# EAGLE design kicik-up (EAGLE 7.2.0)
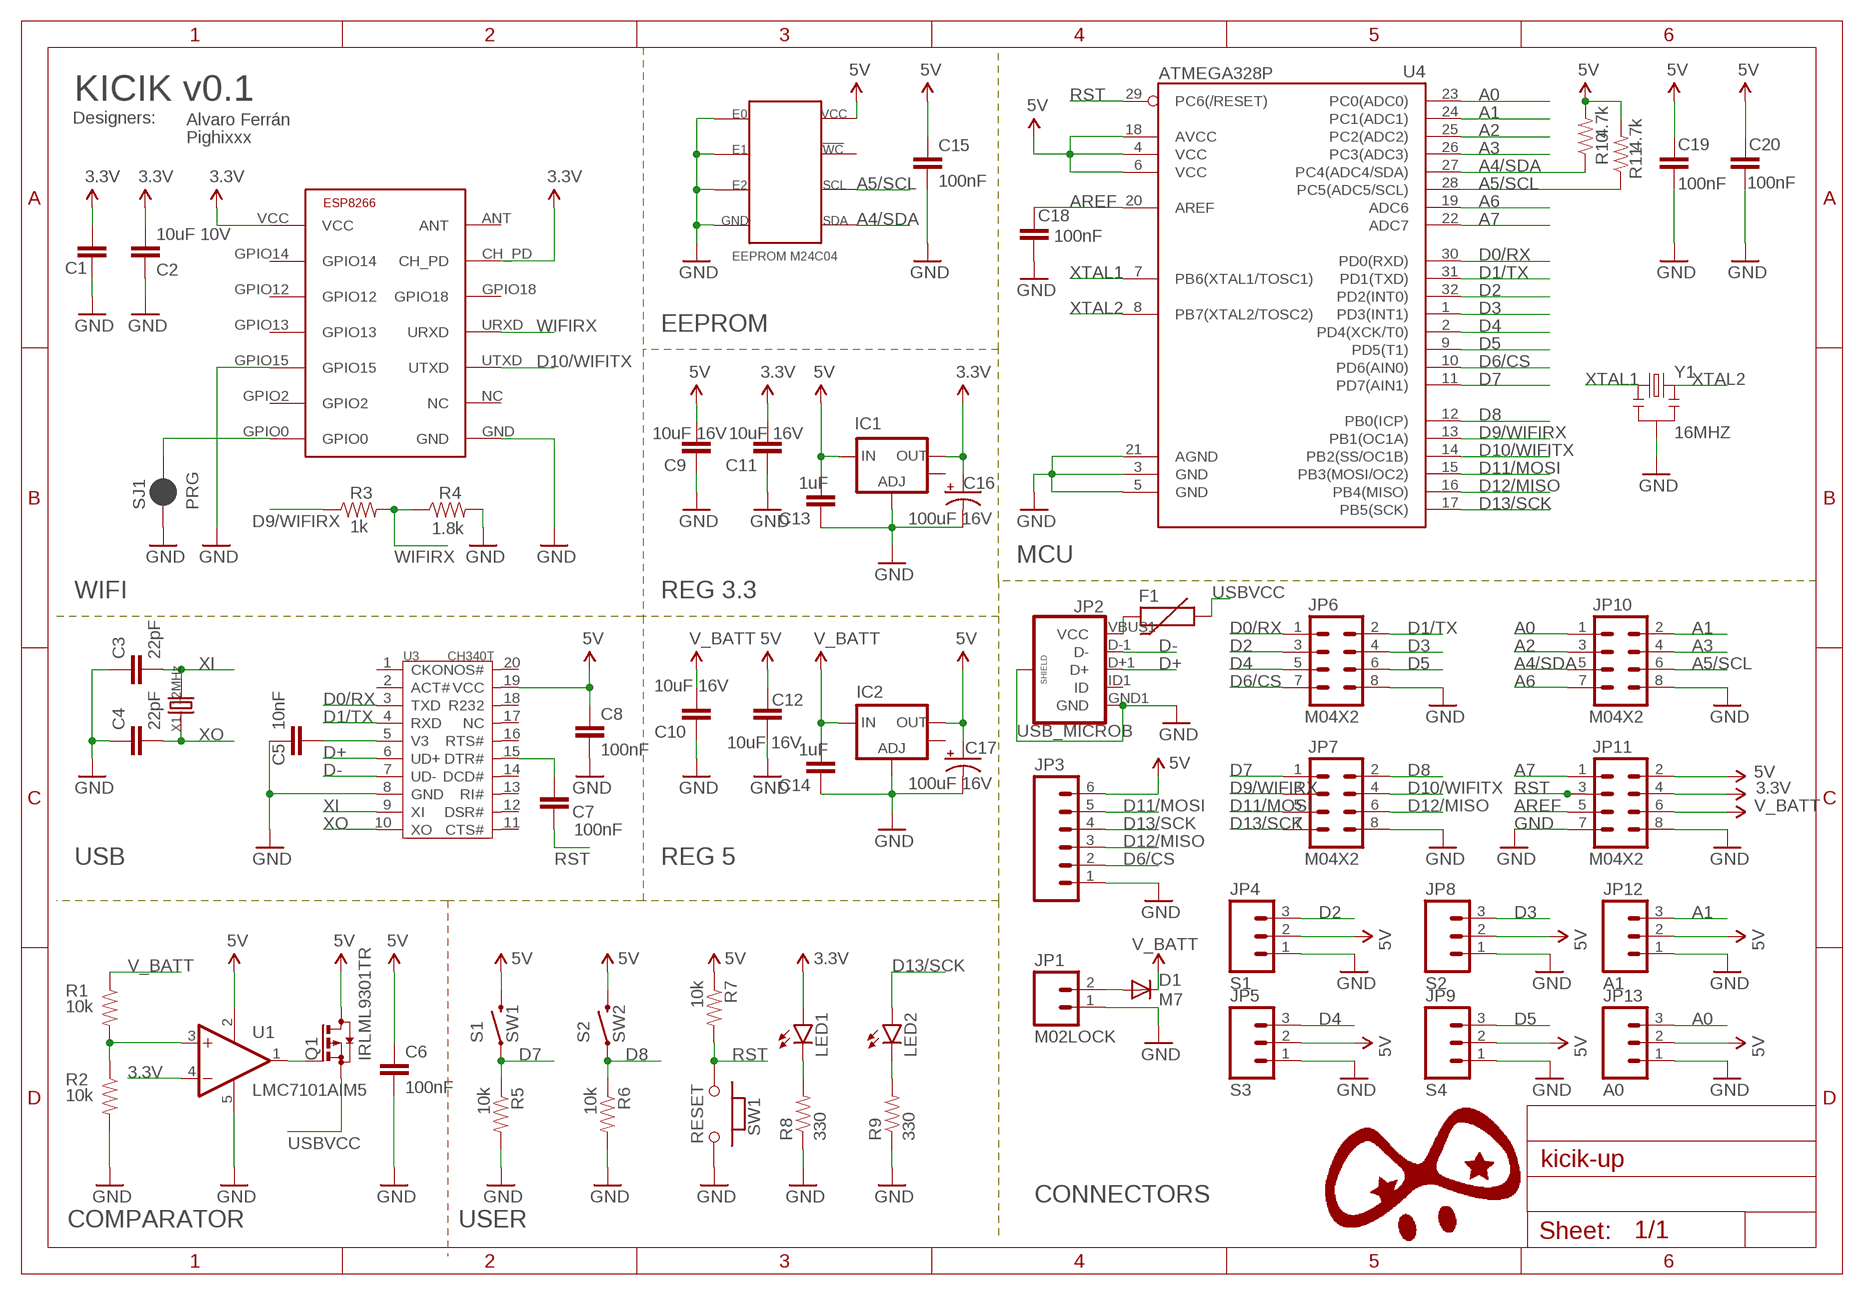
[diagram p0: schematic, sheet 1]

## Parts
C1  0.1uF  CAP0402-CAP  [0402-CAP]
C2  10uF 10V  CAP0402-CAP  [0402-CAP]
C3  22pF  CAP0402-CAP  [0402-CAP]
C4  22pF  CAP0402-CAP  [0402-CAP]
C5  10nF  CAP0402-CAP  [0402-CAP]
C6  100nF  CAP0402-CAP  [0402-CAP]
C7  100nF  CAP0402-CAP  [0402-CAP]
C8  100nF  CAP0402-CAP  [0402-CAP]
C9  10uF 16V  CAP0402-CAP  [0402-CAP]
C10  10uF 16V  CAP0402-CAP  [0402-CAP]
C11  10uF 16V  CAP0402-CAP  [0402-CAP]
C12  10uF 16V  CAP0402-CAP  [0402-CAP]
C13  1uF  CAP0402-CAP  [0402-CAP]
C14  1uF  CAP0402-CAP  [0402-CAP]
C15  100nF  CAP0402-CAP  [0402-CAP]
C16  100uF 16V  CAP_POLC  [PANASONIC_C]
C17  100uF 16V  CAP_POLC  [PANASONIC_C]
C18  100nF  CAP0402-CAP  [0402-CAP]
C19  100nF  CAP0402-CAP  [0402-CAP]
C20  100nF  CAP0402-CAP  [0402-CAP]
D1  M7  DIODE-SMB  [SMB]
F1  PTC0603  [0603]
IC1  V_REG_LM1117SOT223  [SOT223]
IC2  V_REG_LM1117SOT223  [SOT223]
JP1  M02LOCK  [1X02_LOCK]
JP2  USB_MICROB  USB_MICROB_PLUGCONN-11752  [USB-B-MICRO-SMD_V03]
JP3  M06LOCK  [1X06_LOCK]
JP4  S1  M03LOCK  [1X03_LOCK]
JP5  S3  M03LOCK  [1X03_LOCK]
JP6  M04X2  [2X4]
JP7  M04X2  [2X4]
JP8  S2  M03LOCK  [1X03_LOCK]
JP9  S4  M03LOCK  [1X03_LOCK]
JP10  M04X2  [2X4]
JP11  M04X2  [2X4]
JP12  A1  M03LOCK  [1X03_LOCK]
JP13  A0  M03LOCK  [1X03_LOCK]
LED1  LED0603  [LED-0603]
LED2  LED0603  [LED-0603]
M1  M24C04  [SO08]
Q1  IRLML9301TR  BSS84  [SOT23]
R1  10k  RESISTOR0402-RES  [0402-RES]
R2  10k  RESISTOR0402-RES  [0402-RES]
R3  1k  RESISTOR0402-RES  [0402-RES]
R4  1.8k  RESISTOR0402-RES  [0402-RES]
R5  10k  RESISTOR0402-RES  [0402-RES]
R6  10k  RESISTOR0402-RES  [0402-RES]
R7  10k  RESISTOR0402-RES  [0402-RES]
R8  330  RESISTOR0402-RES  [0402-RES]
R9  330  RESISTOR0402-RES  [0402-RES]
R10  4.7k  RESISTOR0402-RES  [0402-RES]
R11  4.7k  RESISTOR0402-RES  [0402-RES]
S1  SW1  SWITCH-MOMENTARY-2SIDE_EZ  [TACTILE-PTH-SIDEEZ]
S2  SW2  SWITCH-MOMENTARY-2SIDE_EZ  [TACTILE-PTH-SIDEEZ]
SJ1  PRG  JUMPER-PAD-2-NC_BY_PASTE  [PAD-JUMPER-2-NC_BY_PASTE_YES_SILK]
SW1  RESET  PB157  [157SW]
U1  LMC7101AIM5  [SOT23-5]
U2  ESP8266  [ESP-03]
U3  CH340T  [SSOP20]
U4  ATMEGA328P  ATMEGA328_SMT  [TQFP32-08]
X1  12MHz  CRYSTAL'5032'  [2P-SMD-5X3.2]
Y1  16MHZ  RESONATOR16MHZ  [RESONATOR-SMD]

## Nets
3.3V: C1.2 C2.2 C11.2 C16.+ IC1.2(OUT) JP11.4 LED1.A U1.4(-IN) U2.CH_PD U2.VCC
5V: C6.1 C8.1 C9.2 C12.2 C13.2 C15.1 C17.+ C19.1 C20.1 IC1.3(IN) IC2.2(OUT) JP3.6 JP4.2 JP5.2 JP8.2 JP9.2 JP11.2 JP12.2 JP13.2 M1.8(VCC) Q1.3(D) R7.1 R10.2 R11.2 S1.2 S2.2 U1.2(V+) U3.19(VCC) U4.4(VCC) U4.6(VCC) U4.18(AVCC)
A0: JP10.1 JP13.3 U4.23(PC0(ADC0))
A1: JP10.2 JP12.3 U4.24(PC1(ADC1))
A2: JP10.3 U4.25(PC2(ADC2))
A3: JP10.4 U4.26(PC3(ADC3))
A4/SDA: JP10.5 M1.5(SDA) R10.1 U4.27(PC4(ADC4/SDA))
A5/SCL: JP10.6 M1.6(SCL) R11.1 U4.28(PC5(ADC5/SCL))
A6: JP10.7 U4.19(ADC6)
A7: JP11.1 U4.22(ADC7)
AREF: C18.1 JP11.5 U4.20(AREF)
D0/RX: JP6.1 U3.3(TXD) U4.30(PD0(RXD))
D1/TX: JP6.2 U3.4(RXD) U4.31(PD1(TXD))
D2: JP4.3 JP6.3 U4.32(PD2(INT0))
D3: JP6.4 JP8.3 U4.1(PD3(INT1))
D4: JP5.3 JP6.5 U4.2(PD4(XCK/T0))
D5: JP6.6 JP9.3 U4.9(PD5(T1))
D6/CS: JP3.2 JP6.7 U4.10(PD6(AIN0))
D7: JP7.1 R5.1 S1.1 U4.11(PD7(AIN1))
D8: JP7.2 R6.1 S2.1 U4.12(PB0(ICP))
D9/WIFIRX: JP7.3 R3.1 U4.13(PB1(OC1A))
D10/WIFITX: JP7.4 U2.UTXD U4.14(PB2(SS/OC1B))
D11/MOSI: JP3.5 JP7.5 U4.15(PB3(MOSI/OC2))
D12/MISO: JP3.3 JP7.6 U4.16(PB4(MISO))
D13/SCK: JP3.4 JP7.7 LED2.A U4.17(PB5(SCK))
D+: JP2.D+1(D+) U3.6(UD+)
D-: JP2.D-1(D-) U3.7(UD-)
GND: C1.1 C2.1 C3.1 C4.1 C5.1 C6.2 C8.2 C9.1 C10.1 C11.1 C12.1 C13.1 C14.1 C15.2 C16.- C17.- C18.2 C19.2 C20.2 IC1.1(ADJ) IC2.1(ADJ) JP1.1 JP2.GND1(GND) JP2.SHIELD1(SHIELD) JP2.SHIELD2(SHIELD) JP2.SHIELD3(SHIELD) JP3.1 JP4.1 JP5.1 JP6.8 JP7.8 JP8.1 JP9.1 JP10.8 JP11.7 JP11.8 JP12.1 JP13.1 M1.1(E0) M1.2(E1) M1.3(E2) M1.4(GND) R2.2 R4.2 R5.2 R6.2 R8.1 R9.1 SJ1.1 SW1.2 U1.5(V-) U2.GND U2.GPIO15 U3.8(GND) U4.3(GND) U4.5(GND) U4.21(AGND) Y1.2
N$1: C7.1 U3.15(DTR#)
N$2: LED1.C R8.2
N$3: F1.2 JP2.VBUS1(VCC)
N$4: R1.2 R2.1 U1.3(+IN)
N$6: SJ1.2 U2.GPIO0
N$8: D1.A JP1.2
N$22: LED2.C R9.2
N$25: Q1.1(G) U1.1(OUT)
RST: C7.2 JP11.3 R7.2 SW1.1 U4.29(PC6(/RESET))
USBVCC: F1.1 Q1.2(S)
V3: C5.2 U3.5(V3)
V_BATT: C10.2 C14.2 D1.C IC2.3(IN) JP11.6 R1.1
WIFIRX: R3.2 R4.1 U2.URXD
XI: C3.2 U3.9(XI) X1.2
XO: C4.2 U3.10(XO) X1.1
XTAL1: U4.7(PB6(XTAL1/TOSC1)) Y1.1
XTAL2: U4.8(PB7(XTAL2/TOSC2)) Y1.3
Unconnected: IC1.4(OUT) IC2.4(OUT) JP2.ID1(ID) M1.7(!WC) U2.ANT U2.GPIO2 U2.GPIO12 U2.GPIO13 U2.GPIO14 U2.GPIO18 U2.NC U3.1(CKO) U3.2(ACT#) U3.11(CTS#) U3.12(DSR#) U3.13(RI#) U3.14(DCD#) U3.16(RTS#) U3.17(NC) U3.18(R232) U3.20(NOS#)

## Notes on the sheet
- KICIK v0.1
- Designers: | Alvaro Ferrán
- Pighixxx
- EEPROM
- MCU
- WIFI | REG 3.3
- USB | REG 5
- CONNECTORS
- COMPARATOR | USER

## Library data of the parts
C1-C15 C18-C20 = SparkFun-Passives:CAP: Capacitor Standard 0603 ceramic capacitor, and 0.1" leaded capacitor.
C16 C17 = SparkFun-Capacitors:CAP_POL: Capacitor Polarized These are standard SMD and PTH capacitors. Normally 10uF, 47uF, and 100uF in electrolytic and tantalum varieties. Always verify the external diameter of the through hole cap, it varies with capacity, voltage, and manufacturer. The EIA devices should be standard.
D1 = diode:DIODE-: DIODE
F1 = SparkFun-PowerIC:PTC: Resettable Fuse PTC Resettable Fuse. Spark Fun Electronics SKU : COM-08357
IC1 IC2 = SparkFun-PowerIC:V_REG_LM1117: Voltage Regulator LM1117 Standard adjustable voltage regulator but in SMD form. Spark Fun Electronics SKU : COM-00595; PROD_ID: VREG-08170
JP1 = SparkFun-Connectors:M02: Standard 2-pin 0.1" header. Use with - straight break away headers ( PRT-00116) - right angle break away headers (PRT-00553) - swiss pins (PRT-00743) - machine pins (PRT-00117) - female headers (PRT-00115) Molex polarized connector foot print use with: PRT-08233 with associated crimp pins and housings. 2.54_SCREWTERM for use with PRT-10571. 3.5mm Screw Terminal footprints for PRT-08084 5mm Screw Terminal footprints for use with PRT-08432
JP2 = SparkFun-Connectors:USB_MICROB_PLUG: USB Micro-B connectors Some male, some female. Watch your step!; PROD_ID: CONN-11752
JP3 = SparkFun-Connectors:M06: Header 6 Standard 6-pin 0.1" header. Use with straight break away headers (SKU : PRT-00116), right angle break away headers (PRT-00553), swiss pins (PRT-00743), machine pins (PRT-00117), and female headers (PRT-00115). Molex polarized connector foot print use with SKU : PRT-08094 with associated crimp pins and housings. NOTES ON THE VARIANTS LOCK and LOCK_LONGPADS... This footprint was designed to help hold the alignment of a through-hole component (i.e. 6-pin header) while soldering it into place. You may notice that each hole has been shifted either up or down by 0.005 of an inch from it's more standard position (which is a perfectly straight line). This slight alteration caused the pins (the squares in the middle) to touch the edges of the holes. Because they are alternating, it causes a "brace" to hold the component in place. 0.005 has proven to be the perfect amount of "off-center" position when using our standard breakaway headers. Although looks a little odd when you look at the bare footprint, once you have a header in there, the alteration is very hard to notice. Also,if you push a header all the way into place, it is covered up entirely on the bottom side. This idea of altering the position of holes to aid alignment will be further integrated into the Sparkfun Library for other footprints. It can help hold any component with 3 or more connection pins.
JP4 JP5 JP8 JP9 JP12 JP13 = SparkFun-Connectors:M03: Header 3 Standard 3-pin 0.1" header. Use with straight break away headers (SKU : PRT-00116), right angle break away headers (PRT-00553), swiss pins (PRT-00743), machine pins (PRT-00117), and female headers (PRT-00115). Molex polarized connector foot print use with SKU : PRT-08232 with associated crimp pins and housings.
JP6 JP7 JP10 JP11 = SparkFun-Connectors:M04X2: .1" header, two rows of four.
LED1 LED2 = SparkFun-LED:LED: LEDs Standard schematic elements and footprints for 5mm, 3mm, 1206, and 0603 sized LEDs. 5mm - Spark Fun Electronics SKU : COM-00529 (and others)
M1 = pighiXXX:M24C04: ST MICROELECTRONICS M24C04-WMN6P Memory; EEPROM; I2C; 512x8bit; 2.5÷5.5V; SO8
Q1 = transistor-small-signal:BSS84: P-CHANNEL MOS FET
R1-R11 = SparkFun-Passives:RESISTOR: Resistor Basic schematic elements and footprints for 0603, 1206, and PTH resistors.
S1 S2 = SparkFun-Electromechanical:SWITCH-MOMENTARY-2: Various NO switches- pushbuttons, reed, etc
SJ1 = SparkFun-Passives:JUMPER-PAD-2-NC_BY_PASTE
SW1 = MySMD:PB157
U1 = linear:LMC7101AIM5
U2 = ESP8266:ESP8266: low cost Wifi to Serial Module
U3 = template:CH340T
U4 = SparkFun-DigitalIC:ATMEGA328_SMT: 32-Pin Atmega328 part Commonly used on Arduino compatible boards Available in QFP and QFN packages TQFP is IC-09069 QFN is non-stock; PROD_ID: IC-09069
X1 = Discrete:CRYSTAL*: CRYSTAL
Y1 = SparkFun-FreqCtrl:RESONATOR: Resonator Small SMD resonator. Used, eg, on the Arduino Pro/ Pro Mini boards. 8MHz- XTAL-08895 16MHz- XTAL-08900; PROD_ID: XTAL-08900

## Net classes
0 default: width 0.254 mm, drill 0.254 mm, clearance 0.203 mm
1 power: width 0.61 mm, drill 0.61 mm, clearance 0.254 mm
2 gnd: width 0.305 mm, drill 0.559 mm, clearance 0.254 mm
3 usbvcc: width 0.508 mm, drill 0.61 mm, clearance 0.254 mm
4 aref: width 0.406 mm, drill 0.61 mm, clearance 0.254 mm

## Board
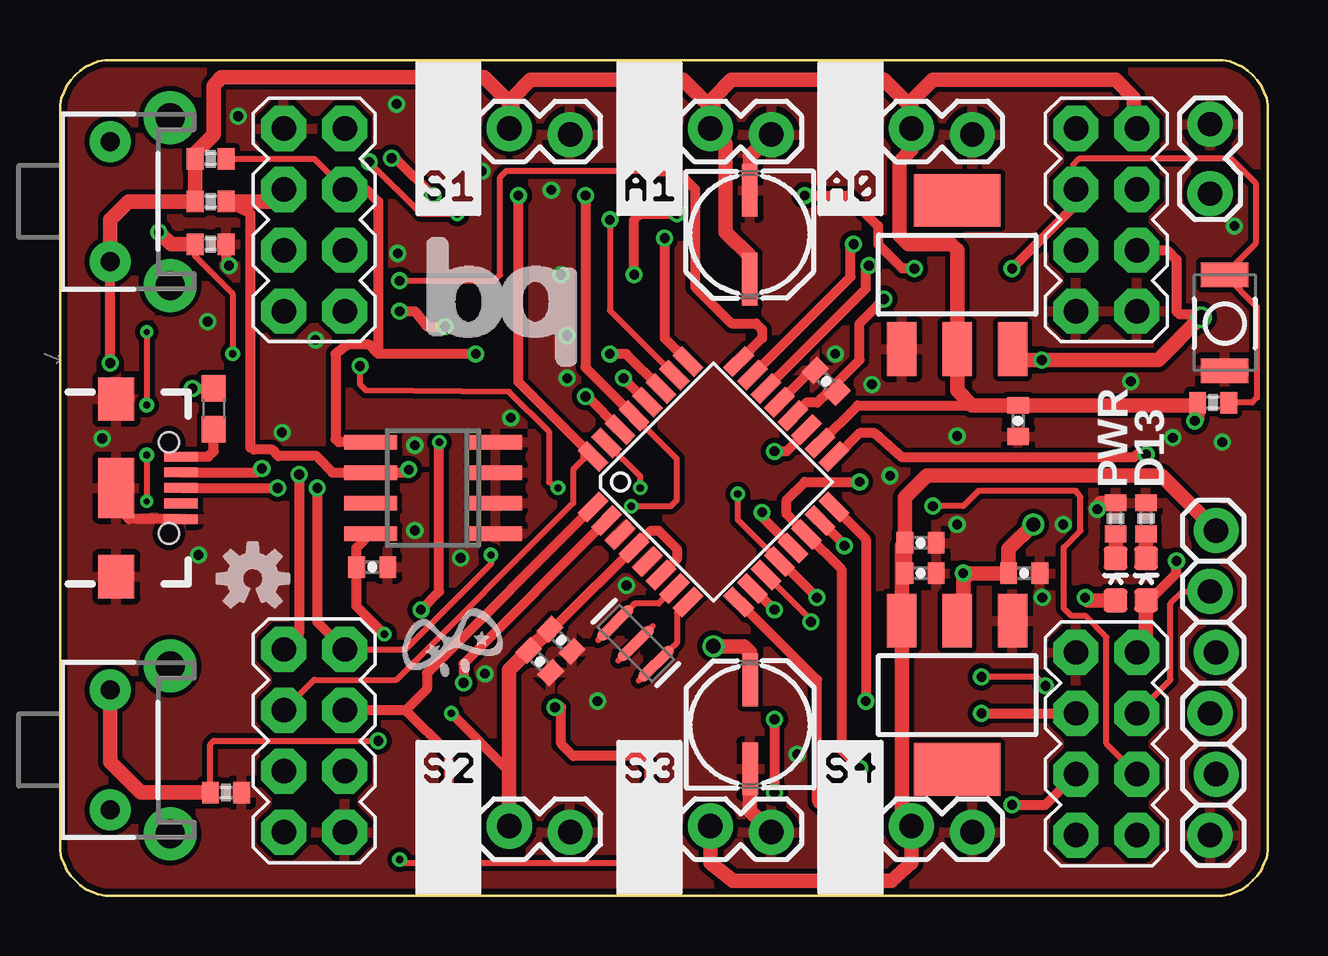
[diagram p1: board, top side]
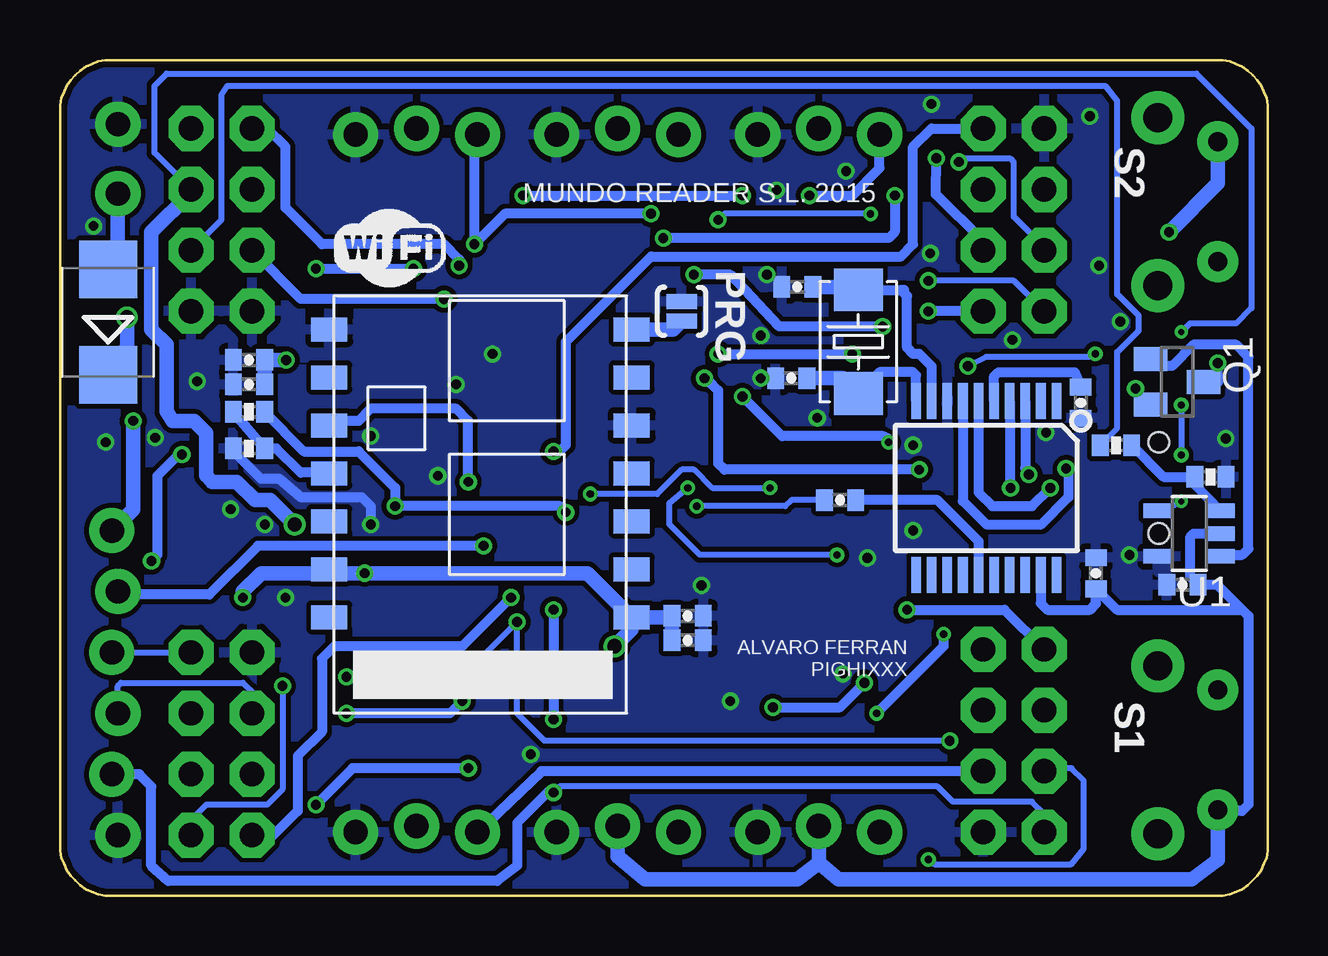
[diagram p2: board, bottom side, seen from below]

Size 50.35 x 34.84 mm. Coordinates in mm from the lower left corner, seen from the top.
Outline: 50.35,32.97 50.35,1.88 50.29,1.59 50.18,1.33 50.07,1.07 49.91,0.84 49.71,0.64 49.52,0.44 49.28,0.28 49.02,0.17 48.76,0.06 48.48,0 1.88,0 1.59,0.06 1.33,0.17 1.07,0.28 0.84,0.44 0.44,0.84 0.28,1.07 0.17,1.33 0.06,1.59 0,1.88 0,32.97 0.06,33.25 0.17,33.51 0.28,33.78 0.44,34.01 0.64,34.21 0.84,34.4 1.07,34.56 1.33,34.67 1.59,34.78 1.88,34.84 48.48,34.84 48.76,34.78 49.02,34.67 49.28,34.56 49.52,34.4 49.71,34.21 49.91,34.01 50.07,33.78 50.18,33.51 50.29,33.25 50.35,32.97
Copper layers (1*16): Top 0.035mm / dielectric 1.5mm / Bottom 0.035mm
Design rules "pighixxx_CAM_DRC_V1.0": minimum track width 6mil, minimum drill 12mil, track to track 6mil, track to pad 6mil, pad to pad 6mil, via to via 6mil, smd to smd 0mil, copper to edge 10mil, drill to drill 10mil, minimum pad ring 10mil, minimum via ring 6mil, stop-mask expansion 2mil, vias tented up to drill 100mil, thermal gap 10mil

### Footprints (pad centres in the part's own frame; a part is rotated, then mirrored left to right if it is on the bottom)
0402-CAP = smd 0.7 x 0.9: 1 -0.65,0; 2 0.65,0
PANASONIC_C = smd 2.2 x 0.65: + 1.9,-0.2; - -1.8,-0.2
SMB = smd 2.4 x 2.4: A 2.2,0; C -2.2,0
0603 = smd 1.1 x 1: 1 -0.85,0; 2 0.85,0
SOT223 = smd 1.219 x 2.235: 1 -2.311,-3.099; 2 0,-3.099; 3 2.311,-3.099 | smd 3.6 x 2.2: 4 0,3.099
1X02_LOCK = drill 1.016 pad 1.88: 1 -0.178,0; 2 2.718,0
USB-B-MICRO-SMD_V03 = smd 1.4 x 0.4: D+1 2.7,0; D-1 2.7,0.65; GND1 2.7,-1.3; ID1 2.7,-0.65; VBUS1 2.7,1.3 | smd 1.5 x 1.8: SHIELD1 0,3.7; SHIELD2 0,-3.7 | smd 1.5 x 2.5: SHIELD3 0,0 | hole 0.85: 2.2,1.9; 2.2,-1.9
1X06_LOCK = drill 1.016 pad 1.88: 1 0,0; 2 2.54,-0.254; 3 5.08,0; 4 7.62,-0.254; 5 10.16,0; 6 12.7,-0.254
1X03_LOCK = drill 1.016 pad 1.88: 1 0,0.127; 2 2.54,-0.127; 3 5.08,0.127
2X4 = drill 1.016 pad 1.88 octagon: 1 -3.81,-1.27; 2 -3.81,1.27; 3 -1.27,-1.27; 4 -1.27,1.27; 5 1.27,-1.27; 6 1.27,1.27; 7 3.81,-1.27; 8 3.81,1.27
LED-0603 = smd 1 x 1: A 0,-0.877; C 0,0.877
SO08 = smd 0.6 x 2.2: 1 -1.905,-2.6; 2 -0.635,-2.6; 3 0.635,-2.6; 4 1.905,-2.6; 5 1.905,2.6; 6 0.635,2.6; 7 -0.635,2.6; 8 -1.905,2.6
SOT23 = smd 1 x 1.4: 1 -0.95,-1.1; 2 0.95,-1.1; 3 0,1.1
0402-RES = smd 0.7 x 0.9: 1 -0.65,0; 2 0.65,0
TACTILE-PTH-SIDEEZ = drill 0.8 pad 1.7: 1 -2.5,0; 2 2.5,0 | drill 1.2 pad 2.2: ANCHOR1 -3.5,2.5; ANCHOR2 3.5,2.5
PAD-JUMPER-2-NC_BY_PASTE_YES_SILK = smd 0.635 x 1.27: 1 -0.401,0; 2 0.413,0
157SW = smd 1.016 x 1.981: 1 0,0; 2 4,0
SOT23-5 = smd 0.6 x 1.2: 1 -0.95,-1.306; 2 0,-1.306; 3 0.95,-1.306; 4 0.95,1.306; 5 -0.95,1.306
ESP-03 = smd 1 x 1.5: ANT 4,12.4; CH_PD 6,12.4; GND 16,12.4; GPIO0 16,-0.2; GPIO2 14,-0.2; GPIO12 8,-0.2; GPIO13 10,-0.2; GPIO14 6,-0.2; GPIO15 12,-0.2; GPIO18 8,12.4; NC 14,12.4; URXD 10,12.4; UTXD 12,12.4; VCC 4,-0.2
SSOP20 = smd 0.4 x 1.5: 1 -2.925,-3.625; 2 -2.275,-3.625; 3 -1.625,-3.625; 4 -0.975,-3.625; 5 -0.325,-3.625; 6 0.325,-3.625; 7 0.975,-3.625; 8 1.625,-3.625; 9 2.275,-3.625; 10 2.925,-3.625; 11 2.925,3.625; 12 2.275,3.625; 13 1.625,3.625; 14 0.975,3.625; 15 0.325,3.625; 16 -0.325,3.625; 17 -0.975,3.625; 18 -1.625,3.625; 19 -2.275,3.625; 20 -2.925,3.625
TQFP32-08 = smd 1.27 x 0.559: 1 -4.293,2.8; 2 -4.293,2; 3 -4.293,1.2; 4 -4.293,0.4; 5 -4.293,-0.4; 6 -4.293,-1.2; 7 -4.293,-2; 8 -4.293,-2.8; 17 4.293,-2.8; 18 4.293,-2; 19 4.293,-1.2; 20 4.293,-0.4; 21 4.293,0.4; 22 4.293,1.2; 23 4.293,2; 24 4.293,2.8 | smd 0.559 x 1.27: 9 -2.8,-4.293; 10 -2,-4.293; 11 -1.2,-4.293; 12 -0.4,-4.293; 13 0.4,-4.293; 14 1.2,-4.293; 15 2,-4.293; 16 2.8,-4.293; 25 2.8,4.293; 26 2,4.293; 27 1.2,4.293; 28 0.4,4.293; 29 -0.4,4.293; 30 -1.2,4.293; 31 -2,4.293; 32 -2.8,4.293
2P-SMD-5X3.2 = smd 1.778 x 2.032: 1 -2.159,0; 2 2.159,0
RESONATOR-SMD = smd 0.45 x 1.905: 1 -1.2,0; 2 0,0; 3 1.2,0

### Placement (x,y rotation side)
C1  24.19,11.67 180 bottom
C2  24.19,10.65 180 bottom
C3  19.62,25.39 0 bottom
C4  19.87,21.58 0 bottom
C5  7.81,20.56 90 bottom
C6  3.56,12.97 180 bottom
C7  17.84,16.5 180 bottom
C8  7.17,13.45 90 bottom
C9  35.87,14.72 180 top
C10  42.48,21.32 0 bottom
C11  40.19,13.45 180 top
C12  39.94,19.8 90 top
C13  35.87,13.45 180 top
C14  42.48,22.34 0 bottom
C15  13.01,13.7 0 top
C16  28.57,7.1 90 top
C17  28.95,27.61 270 top
C18  31.94,21.45 135 top
C19  20,9.77 315 top
C20  20.89,10.65 315 top
D1  48.34,23.91 90 bottom
F1  6.41,20.31 270 top
IC1  37.4,8.37 180 top
IC2  37.4,25.89 0 top
JP1  47.94,31.99 270 top
JP2  2.34,17 0 top
JP3  47.94,2.53 90 top
JP4  21.27,31.86 180 top
JP5  29.65,2.78 180 top
JP6  10.6,6.46 270 top
JP7  43.62,6.34 90 top
JP8  21.27,2.78 180 top
JP9  38.03,2.78 180 top
JP10  10.6,28.18 90 top
JP11  43.62,28.18 270 top
JP12  29.65,31.86 180 top
JP13  38.03,31.86 180 top
LED1  44,13.19 0 top
LED2  45.27,13.19 0 top
LOGO3  OSHW-LOGOS  [OSHW-LOGO-S]  8.03,13.22 0 top
M1  15.55,17 90 top
Q1  3.79,21.42 270 bottom
R1  6.33,18.78 0 bottom
R2  2.4,17.46 0 bottom
R3  42.48,20.18 180 bottom
R4  42.48,18.66 180 bottom
R5  6.92,4.3 0 top
R6  6.28,27.16 0 top
R7  48.06,20.56 0 top
R8  44,15.73 270 top
R9  45.27,15.73 270 top
R10  6.28,30.72 180 top
R11  6.28,28.94 180 top
S1  2.09,6.08 270 top
S2  2.09,28.94 270 top
SJ1  24.44,24.37 270 bottom
SW1  48.55,25.89 270 top
U1  3.28,15.1 90 bottom
U2  26.73,7.61 90 bottom
U3  11.74,17 180 bottom
U4  27.24,17.26 45 top
U$1  [S_WIFI]  38.92,25.39 0 bottom
U$2  [PIGHIXXX_LOGO]  14.28,9.13 0 top
U$3  [BQ_LOGO]  15.3,22.08 0 top
U$4  [S_S1]  14.79,28.18 0 top
U$5  [S_A1]  23.17,28.18 0 top
U$6  [S_A0]  31.55,28.18 0 top
U$7  [S_S2]  14.79,6.72 0 top
U$8  [S_S3]  23.17,6.72 0 top
U$9  [S_S4]  31.55,6.72 0 top
X1  17.08,23.1 90 bottom
Y1  24,10.53 315 top

### Tracks (layer width: path | path; a pad name or v marks a point on that pad's centre or on a via)
3.3V  (via drill 0.25, 0.3, 0.41, 0.6)
  Top 0.254: v3.61,23.51 v3.61,20.46 | v3.61,18.38 v3.61,16.45
  Top 0.61: IC1.2 37.65,11.98 37.65,13.19 37.9,13.45 v37.65,13.45 C11.2 39.54,14.45 v40.57,15.48 | LED1.A 42.85,12.32 v42.73,12.43 | C16.+ 28.77,10.14 28.51,10.4 v27.24,10.4
  Bottom 0.254: JP11.4 46.41,30.97 46.41,33.77 45.91,34.28 2.98,34.28 0.69,31.99 0.69,24.5 1.33,23.86 3.26,23.86 v3.61,23.51 | v3.61,16.45 4.32,16.05 U1.4 | v3.61,20.46 v3.61,18.38
  Bottom 0.61: 39.08,13.61 U2.CH_PD 38.97,13.45 v37.65,13.45 | v42.73,12.43 42.73,12.69 41.97,13.45 v37.65,13.45 | C2.2 C1.2 24.9,11.61 U2.VCC | U2.VCC 28.37,13.45 v37.65,13.45 | v40.57,15.48 41.59,16.5 42.22,16.5 42.98,17.26 44,17.26 44.25,17.51 44.25,19.29 44.76,19.8 45.65,19.8 45.91,20.18 45.91,22.97 46.54,23.61 46.54,27.67 44.89,29.32 JP11.4 | v27.24,10.4 26.53,11.11 U2.VCC
5V  (via drill 0.3, 0.41)
  Top 0.406: U4.6 25.71,14.04 25.71,14.46 24.95,15.23 24.64,15.23 U4.4 20.78,11.37 C20.1 | U4.18 33.25,20.45 38.16,20.45 | v2.09,22.21 S2.2 | C15.1 12.36,14.51 M1.8 | C15.1 12.36,13.34 | v16.31,7.61 18.73,5.19 JP8.2 | v13.52,10.91 12.36,12.07 C15.1
  Top 0.61: v47.3,19.8 47.41,19.91 R7.1 47.3,20.45 C12.2 38.16,20.45 38.02,20.45 37.4,21.07 IC2.2 37.4,26.91 37.14,27.16 35.36,27.16 34.98,27.55 34.98,30.59 35.49,31.1 JP13.2 | 35.09,14.58 IC1.3 35.09,3.31 JP9.2 35.49,1.38 34.67,0.62 28.06,0.62 27.11,1.38 JP5.2 | 35.09,14.58 C9.2 35.22,16.61 36.13,17.51 45.91,17.51 JP3.6 | JP13.2 35.49,33.13 36.38,34.02 44,34.02 44.76,33.26 44.76,32.12 JP11.2 | JP13.2 35.49,32.88 34.35,34.02 28,34.02 27.24,33.26 27.24,32.12 JP12.2 | JP12.2 27.11,32.88 25.97,34.02 19.62,34.02 18.85,33.26 18.85,32.12 JP4.2 | JP4.2 18.73,32.63 | S2.2 2.09,28.18 2.85,28.94 R11.2 R10.2 5.63,30.96 6.41,31.74 6.41,33.77 6.69,34.1 6.71,34.12 17.69,34.12 18.73,33.08 JP4.2 | C20.1 C19.1 18.73,9.41 JP8.2 | 35.09,14.58 35.22,14.44 C13.2 | JP12.2 27.74,31.36 27.74,27.67 28.75,26.67 C17.+
  Bottom 0.406: U3.19 9.47,12.19 9.2,11.92 7.42,11.92 7.17,12.18 C8.1 6.3,11.92 1.07,11.92 | 1.07,11.92 0.82,11.67 0.82,3.8 1.07,3.54 2.05,3.54 S1.2 | v13.52,10.91 13.52,10.4 v16.31,7.61 | Q1.3 2.09,21.41 v2.09,22.21 | 1.07,11.92 2.12,12.97 C6.1 3.23,13.29 3.23,14.97 3.11,15.1 U1.2
  Bottom 0.61: v47.3,19.8 47.3,16.12 JP3.6 | 18.73,1.38 19.62,0.68 25.97,0.68 27.11,1.64 JP5.2 | S1.2 2.09,1.51 3.17,0.68 17.9,0.68 18.73,1.38 | 18.73,1.38 JP8.2
A0  (via drill 0.41)
  Top 0.406: U4.23 32.95,25.8 32.95,27.04 arc-90 v33.08,27.16 | v14.16,24.37 14.79,24.37 15.3,23.74 v16.06,23.74 | v23.93,25.89 23.93,28.18 24.19,28.43 v25.71,28.43
  Bottom 0.406: JP13.3 arc-90 33.08,31.61 v33.08,27.16 31.81,28.43 v25.71,28.43 | JP10.1 v14.16,24.37 | v16.06,23.74 20.38,23.74 22.41,25.89 v23.93,25.89
A1  (via drill 0.41)
  Top 0.254: 24.95,30.21 18.6,30.21 18.35,29.96 18.35,25.89 18.09,25.64 v14.16,25.64
  Top 0.406: JP12.3 24.57,30.59 24.95,30.21 25.71,30.21 26.47,29.45 26.47,25.39 28,23.86 29.01,23.86 29.27,23.61 29.27,23.25 U4.24
  Bottom 0.254: JP10.2 10.6,25.64 v14.16,25.64
A2  (via drill 0.41)
  Top 0.406: v13.83,30.75 14.03,30.7 v15.55,29.2 | v25.2,27.42 25.2,23.25 U4.25
  Bottom 0.406: JP10.3 11.87,27.29 13.85,29.25 v13.83,30.75 | v25.2,27.42 15.81,27.42 15.55,27.67 v15.55,29.2
A3  (via drill 0.3, 0.41)
  Top 0.254: v22.92,28.18 22.92,24.4 U4.26 | v12.89,30.59 15.04,28.43 v16.57,28.43
  Bottom 0.254: JP10.4 9.33,27.04 10.6,28.31 10.6,30.59 10.73,30.72 12.76,30.72 v12.89,30.59 | v16.57,28.43 22.66,28.43 v22.92,28.18
A4/SDA  (via drill 0.41)
  Top 0.254: R10.1 10.6,30.72 JP10.5
  Top 0.406: M1.5 11.62,18.91 11.49,19.04 11.49,22.59 12,22.97 12.89,22.97 13.27,22.59 | JP10.5 12.76,29.45 13.27,28.94 13.27,22.59 | U4.27 23.6,22.59 v22.92,22.59 | v17.33,22.59 13.27,22.59
  Bottom 0.406: v22.92,22.59 v17.33,22.59
A5/SCL  (via drill 0.41)
  Top 0.406: R11.1 7.93,28.45 7.93,18.68 8.08,18.6 8.85,18.6 9.1,18.33 10.7,18.33 11.36,17.64 M1.6 14.41,17.64 v14.54,17.77 | v23.49,21.58 23.74,21.32 U4.28
  Top 0.61: JP10.6 8.82,28.94 R11.1
  Bottom 0.406: v14.54,17.77 22.66,17.77 22.92,18.02 22.92,21.07 23.17,21.32 v23.49,21.58
A6  (via drill 0.41)
  Top 0.406: U4.19 31.12,19.36 30.28,18.53 v29.78,18.53
  Bottom 0.406: v29.78,18.53 29.52,18.53 29.27,18.78 29.27,23.1 25.71,26.66 15.3,26.66 14.79,27.16 14.79,31.23 14.03,31.99 JP10.7
A7  (via drill 0.41)
  Top 0.406: U4.22 33.59,25.31 33.59,26.02 v33.71,26.28
  Bottom 0.406: v33.71,26.28 33.71,26.53 34.35,27.16 39.43,27.16 40.95,28.69 40.95,31.23 41.71,31.99 JP11.1
AREF  (via drill 0.41)
  Top 0.406: v34.35,24.88 33.33,23.86 33.33,22.34 32.27,21.27 C18.1 31.98,20.99 31.55,20.56 31.1,20.56 U4.20
  Bottom 0.406: v34.35,24.88 40.32,24.88 JP11.5
D0/RX  (via drill 0.3, 0.41)
  Top 0.406: v9.96,17.56 9.96,10.91 JP6.1 | U4.30 21.98,20.81 v21.9,20.81 | v15.04,11.92 15.81,12.69 v15.81,18.91
  Bottom 0.406: U3.3 10.12,17.84 v9.96,17.56 | v21.9,20.81 20.25,19.16 16.06,19.16 15.81,19.04 v15.81,18.91 | v15.04,11.92 10.98,11.92 JP6.1
D1/TX  (via drill 0.3, 0.41)
  Top 0.254: JP6.2 14.41,10.27 17.97,13.83 v17.97,14.21 | U4.31 24.19,17.48 v24.19,17
  Top 0.406: v10.73,17 10.73,11.42 JP6.2
  Bottom 0.254: v17.97,14.21 23.68,14.21 24.95,15.48 24.95,16.37 v24.19,17
  Bottom 0.406: U3.4 10.77,17.05 v10.73,17
D2  (via drill 0.41)
  Top 0.254: JP6.3 10.6,9 14.03,9 21.39,16.37 21.39,17.77 21.83,18.2 21.83,18.71
  Top 0.406: U4.32 21.83,18.71 19.11,21.43 v19.11,29.2
  Bottom 0.406: JP4.3 16.19,30.34 17.33,29.2 v19.11,29.2
D3
  Top 0.406: 14.41,7.73 15.3,8.62 15.3,9.28 U4.1 | 14.41,7.73 JP6.4 | 14.41,7.73 16.19,5.96 JP8.3
D4  (via drill 0.3, 0.41)
  Top 0.254: v14.16,1.51 14.35,1.38 24.12,1.38 24.57,1.64 JP5.3
  Top 0.406: JP5.3 24.57,5.45 24.19,5.83 21.39,5.83 20.89,6.34 20.89,7.86 v20.63,7.86 | U4.2 16.82,9.67 v16.82,8.88
  Bottom 0.254: v14.16,1.51 13.9,1.32 8.19,1.32 7.68,1.96 7.68,4.81 8.19,5.32 9.2,5.32 JP6.5
  Bottom 0.406: v20.63,7.86 17.84,7.86 v16.82,8.88
D5
  Top 0.406: JP9.3 31.55,3.92 31.55,9 U4.9
  Bottom 0.406: JP6.6 30.28,5.19 JP9.3
D6/CS  (via drill 0.41)
  Top 0.254: U4.10 28.89,12.81
  Top 0.406: 28.89,12.81 v29.78,11.92 | v29.78,7.35 v29.78,4.3
  Bottom 0.254: JP6.7 9.33,3.42 9.84,3.92 13.14,3.92 13.77,4.56 29.52,4.56 v29.78,4.3 30.03,4.3
  Bottom 0.406: v29.78,11.92 v29.78,7.35 | 30.03,4.3 31.3,3.03 31.3,1.26 32.13,0.62 45.84,0.62 46.54,1.26 46.54,4.56 47.05,5.07 JP3.2
D7  (via drill 0.41)
  Top 0.254: R5.1 6.27,6.32 6.41,6.46 v13.27,6.46 | v31.3,11.42 31.3,11.5 U4.11 | v38.41,9.13 40.7,9.13 v41.08,8.75
  Top 0.61: S1.1 2.09,5.57 3.36,4.3 R5.1
  Bottom 0.254: v13.27,6.46 30.16,6.46 31.3,7.61 v31.3,11.42 33.59,9.13 v38.41,9.13 | v41.08,8.75 41.08,4.43 41.71,3.8 44.25,3.8 44.76,3.29 44.76,2.65 JP7.1
D8  (via drill 0.3, 0.41)
  Top 0.254: R6.1 5.63,26.67 7.2,25.11 v7.2,22.59 | v20.76,17 20.38,17.26 20.38,19.35 18.73,21.01 12.76,21.07 12.5,21.32 v12.5,22.08 | U4.12 28.25,15.68 v28.25,16.75
  Top 0.406: U4.12 30.05,13.94 v31.55,12.43
  Top 0.61: R6.1 4.63,27.16 v4.12,27.67
  Bottom 0.254: v7.2,22.59 7.04,22.47 11.74,22.47 v12.5,22.08 | v20.76,17 23.17,17 23.93,17.77 24.44,17.77 25.46,16.75 v28.25,16.75
  Bottom 0.406: v31.55,12.43 33.59,10.4 38.92,10.4 39.43,9.89 39.43,6.84 40.44,5.83 40.44,3.54 41.46,2.53 JP7.2
  Bottom 0.61: v4.12,27.67 2.09,29.7 S2.1
D9/WIFIRX  (via drill 0.41)
  Top 0.254: JP7.3 43.62,6.34 43.62,10.78 42.73,11.67 42.16,11.67 41.84,11.99 41.84,14.53 42.54,15.23 42.54,16.62 42.35,16.88 38.29,16.88 37.65,16.24 v36.38,16.24
  Top 0.406: U4.13 29.27,15.79 v29.27,15.99
  Bottom 0.406: v29.27,15.99 29.52,16.24 v36.38,16.24 36.38,17 37.9,18.53 40.19,18.53 41.83,20.16 R3.1 41.71,20.05
D10/WIFITX  (via drill 0.41)
  Top 0.406: v33.33,17.26 31.05,17.26 30.28,16.5 30.28,15.91 U4.14 32.57,13.62 32.57,6.08 v33.33,5.32 | v39.68,3.8 41.08,3.8 JP7.4
  Bottom 0.406: v33.33,5.32 38.16,5.32 v39.68,3.8 | v33.33,17.26 33.33,19.8 33.84,20.31 37.4,20.31 37.9,19.8 38.94,19.8 U2.UTXD
D11/MOSI  (via drill 0.41)
  Top 0.254: JP7.5 46.29,9 46.29,12.18 46.79,12.69 JP3.5
  Top 0.406: U4.15 32.73,14.59 v32.7,14.59
  Bottom 0.406: JP3.5 47.81,12.56 44.13,12.56 42.1,14.59 v32.7,14.59
D12/MISO  (via drill 0.41)
  Top 0.406: v38.41,7.61 JP7.6 | U4.16 33.59,14.87 v33.59,8.11
  Bottom 0.254: JP3.3 47.94,8.75 47.81,8.88 42.73,8.88 42.22,8.37 42.22,7.73 JP7.6
  Bottom 0.406: v33.59,8.11 34.09,7.61 v38.41,7.61
D13/SCK  (via drill 0.41)
  Top 0.254: LED2.A 45.41,12.32 | 32.36,18.31 U4.17
  Top 0.406: 45.41,12.32 46.54,13.45 v46.54,13.96 | v45.27,18.4 44.89,18.4 44.76,18.27 35.11,18.27 33.97,19.29 33.33,19.29 32.36,18.31
  Top 0.61: LED2.A 45.27,10.53 JP7.7
  Bottom 0.254: JP3.4 JP7.7 | v46.54,13.96 46.29,14.21
  Bottom 0.406: 46.29,14.21 46.29,17.51 45.4,18.4 v45.27,18.4
D+  (via drill 0.41)
  Top 0.406: JP2.D+1 v9.08,17
  Bottom 0.406: U3.6 12.07,16.82 11.49,16.24 9.84,16.24 v9.08,17
D-  (via drill 0.41)
  Top 0.406: JP2.D-1 5.06,17.64 8.19,17.64 v8.42,17.82
  Bottom 0.406: U3.7 12.72,16.46 11.74,15.48 9.46,15.48 8.31,16.62 8.31,17.77 v8.42,17.82
GND  (via drill 0.41)
  Top 0.406: JP2.GND1 2.88,15.7 2.34,16.24 JP2.SHIELD3 | C18.2 31.35,21.94 U4.21 | R6.2 6.93,26.42 v7.04,26.28
  Top 0.61: v43.24,16.12 43.38,16.38 R8.1 | C17.- 28.75,30.84 JP12.1 | JP5.1 28.77,3.53 C16.-
  Bottom 0.406: v37.4,15.48 37.4,16.24 37.78,16.62 40.32,16.62 41.21,17.39 41.97,17.39 43.13,18.54 R4.2 43.13,18.67
  other vias: 32.32,22.59 33.84,21.32 20.89,25.89 7.42,32.5 21.14,23.35 21.14,21.58 16.7,14.08 40.95,12.43 34.6,17.51 22.41,8.11 23.62,12.94 37.4,19.16 17.71,9.26 14.79,18.78 18.79,19.93 14.79,15.23 14.03,33.01 17.58,30.21 46.39,19.1 48.45,18.91 44.64,21.45 30.73,5.89 41.82,15.48 48.95,27.93 14.08,26.78 5.77,14.21 20.48,29.42 1.76,19.06 10.65,23.18 6.15,23.94 9.25,19.32
  pour Top: -0.2,34.78 50.35,35.04 50.35,-0.52 0.06,-0.52
  pour Bottom: -0.7,34.78 50.86,35.29 50.86,-0.78 -0.45,-1.03
N$1
  Bottom 0.406: C7.1 13.77,16.5 12.07,14.79 U3.15
N$2
  Top 0.61: LED1.C R8.2
N$3
  Top 0.406: JP2.VBUS1 6.18,18.3 6.41,18.53 F1.2
N$4
  Bottom 0.406: U1.3 3.07,17.17 R2.1 | R1.2 4.36,17.46 R2.1 | R2.1 3.03,17.49 3.03,17.59
N$6
  Bottom 0.61: SJ1.2 24.79,23.61 U2.GPIO0
N$8
  Bottom 0.61: D1.A 47.94,26.9 JP1.2
N$22
  Top 0.61: LED2.C R9.2
N$25
  Bottom 0.406: U1.1 1.92,14.21 1.07,14.21 0.82,14.46 0.82,22.47 1.33,22.97 3.11,22.97 4,22.08 4.9,22.08 Q1.1
RST  (via drill 0.3, 0.41)
  Top 0.254: JP11.3 42.22,29.58 42.22,30.47 42.48,30.72 48.83,30.72 49.84,29.7 49.84,27.19 SW1.1 49.89,24.55 49.89,20.76 49.69,20.56 R7.2 | v23.81,16.24 25.46,16.24 25.71,16.5 25.71,18.22 U4.29
  Top 0.406: v35.62,26.15 35.11,26.15 34.09,27.16 34.09,27.93 32.82,29.2 v31.05,29.2 | v21.9,29.2 21.9,22.03 U4.29 | 42.22,29.58 42.22,28.69 v39.68,26.15
  Bottom 0.254: C7.2 19.87,16.5 20.12,16.24 v23.81,16.24
  Bottom 0.406: v39.68,26.15 v35.62,26.15 | v31.05,29.2 v21.9,29.2
USBVCC  (via drill 0.41)
  Top 0.406: F1.1 5.61,21.16 v5.52,21.14
  Bottom 0.406: v5.52,21.14 5.27,20.42 Q1.2
V3
  Bottom 0.406: U3.5 11.42,21.65 11.23,21.83 8.06,21.83 C5.2
V_BATT  (via drill 0.41, 0.6)
  Top 0.406: 47.56,24.24 v47.56,24.12 47.43,24.24 46.67,24.24 46.54,24.37 46.54,26.53 46.16,26.91 JP11.6
  Top 0.61: IC2.3 40.17,22.34 v40.93,22.34 45.78,22.34 v47.56,24.12
  Bottom 0.254: JP11.6 43.62,28.18 43.62,33.39 43.37,33.77 6.79,33.77 6.28,33.13 6.28,25.08 5.39,24.19 5.39,23.56 6.28,22.67 6.28,19.48 R1.1
  Bottom 0.61: 41.83,21.72 C10.2 C14.2 v40.93,22.34 | v47.56,24.12 47.56,22.88 D1.C
WIFIRX
  Bottom 0.406: U2.URXD 39.16,17.64 40.32,17.64 41.33,18.66 R4.1 R3.2 43.1,20.05
XI
  Bottom 0.406: X1.2 15.3,25.26 | 15.3,25.26 15.17,25.26 | U3.9 14.02,22.07 14.54,22.59 14.79,22.59 15.04,22.85 15.04,25.01 15.3,25.26
  Bottom 0.61: C3.2 17.2,25.39 X1.2
XO
  Bottom 0.406: U3.10 14.67,21.71 14.79,21.83 16.19,21.83 X1.1
  Bottom 0.61: 17.2,21.07 X1.1 17.71,21.58 C4.2
XTAL1
  Top 0.254: U4.7 25.58,12.81 24.95,12.18 23.95,12.18 23.87,12.09
XTAL2
  Top 0.254: U4.8 25.71,11.77 25.71,10.54 25.56,10.4

### Text on the board
tPlace: PWR | D13
bNames: MUNDO READER S.L. 2015 | ALVARO FERRAN / PIGHIXXX